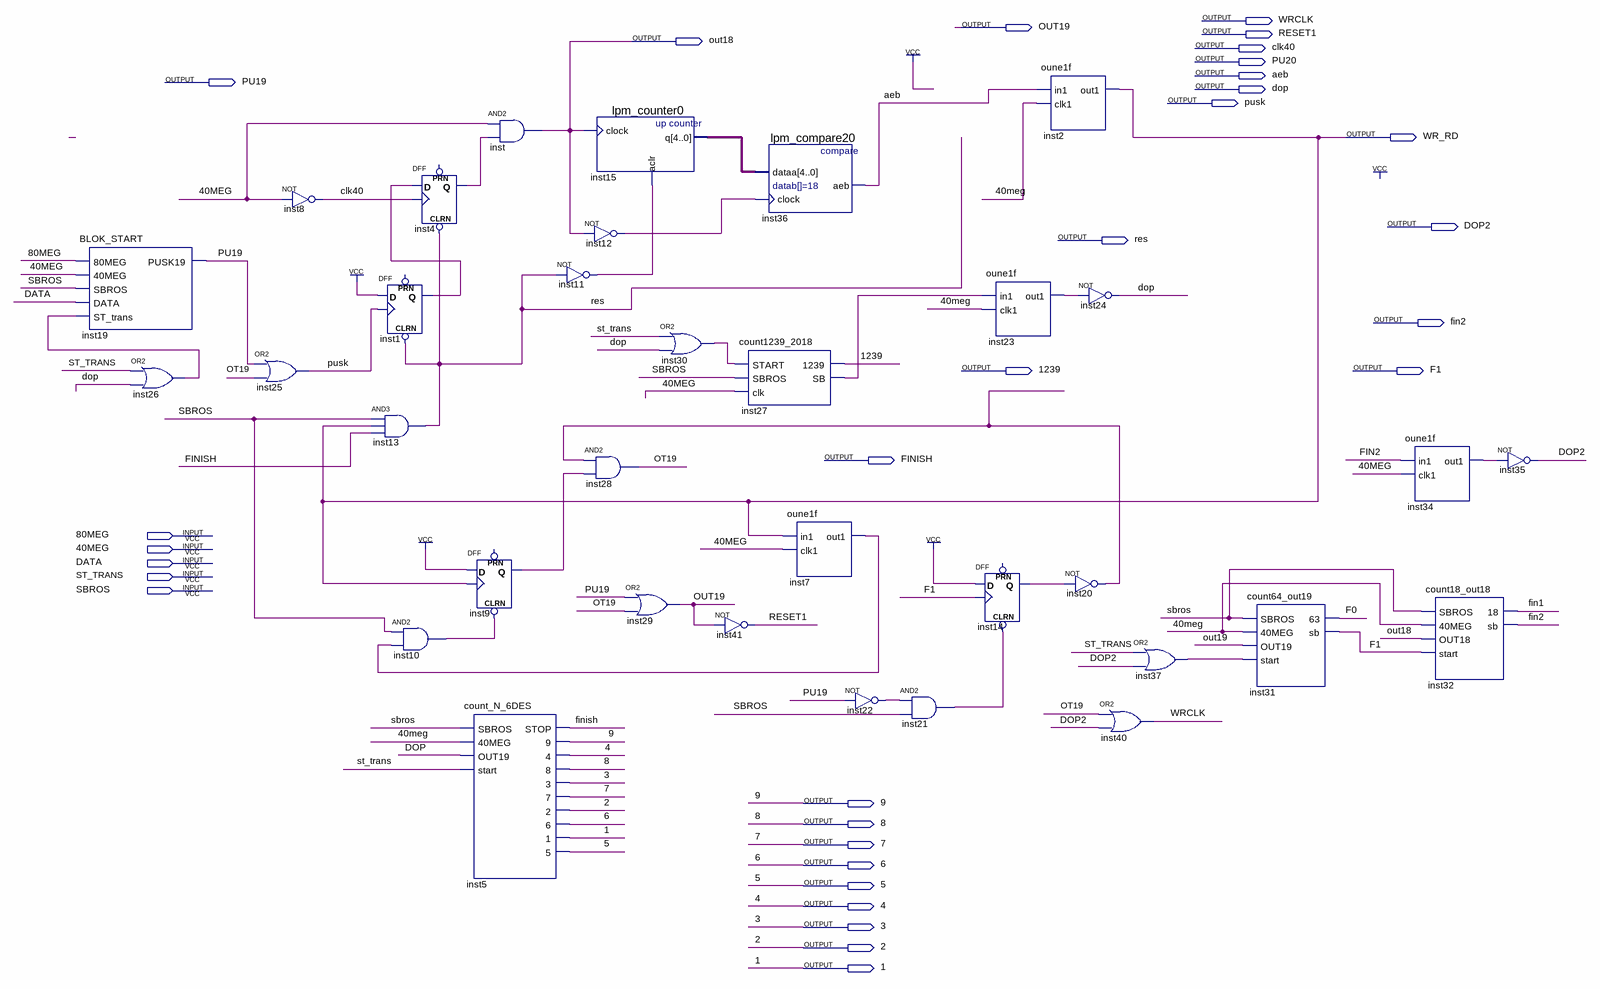
[diagram p0: schematic sheet]
// Quartus schematic BLOK18_19_8DES.bdf as structural Verilog: 34 symbols, 31 pins
module BLOK18_19_8DES (
  input  \80MEG ,
  input  \40MEG ,
  input  DATA,
  input  ST_TRANS,
  input  SBROS,
  output WRCLK,
  output OUT19,
  output RESET1,
  output out18,
  output clk40,
  output PU20,
  output aeb,
  output PU19,
  output dop,
  output pusk,
  output WR_RD,
  output DOP2,
  output res,
  output fin2,
  output \1239 ,
  output F1,
  output FINISH,
  output \9 ,
  output \8 ,
  output \7 ,
  output \6 ,
  output \5 ,
  output \4 ,
  output \3 ,
  output \2 ,
  output \1 
);

  wire F0, fin1, inst1_q, inst4_q, inst7_out1, inst9_q, inst10_out, inst11_out, inst12_out, inst14_q,
       inst20_out, inst21_out, inst22_out, inst23_out1, inst26_out, inst27_sb, inst30_out, inst34_out1,
       inst37_out, OT19;
  wire [4:0] inst15_q;

  BLOK_START inst19 (
    .\80MEG (\80MEG ), .\40MEG (\40MEG ), .SBROS(SBROS), .DATA(DATA), .ST_trans(inst26_out), .PUSK19(PU19));
  or inst26 (inst26_out, ST_TRANS, dop);
  or inst25 (pusk, PU19, OT19);
  not inst8 (clk40, \40MEG );
  and inst13 (res, SBROS, WR_RD, FINISH);
  DFF inst4 (.CLRN(res), .CLK(clk40), .D(inst1_q), .Q(inst4_q));  // open: PRN
  DFF inst1 (.CLRN(res), .CLK(pusk), .D(1'b1), .Q(inst1_q));  // open: PRN
  and inst10 (inst10_out, SBROS, inst7_out1);
  DFF inst9 (.CLRN(inst10_out), .CLK(WR_RD), .D(1'b1), .Q(inst9_q));  // open: PRN
  count_N_6DES inst5 (
    .SBROS(SBROS), .\40MEG (\40MEG ), .OUT19(dop), .start(ST_TRANS), .STOP(FINISH), .\9 (\9 ), .\4 (\4 ),
    .\8 (\8 ), .\3 (\3 ), .\7 (\7 ), .\2 (\2 ), .\6 (\6 ), .\1 (\1 ), .\5 (\5 ));
  and inst (out18, \40MEG , inst4_q);
  lpm_counter0 inst15 (.clock(out18), .aclr(inst11_out), .q(inst15_q));
  not inst12 (inst12_out, out18);
  not inst11 (inst11_out, res);
  and inst28 (OT19, inst20_out, inst9_q);
  or inst29 (OUT19, PU19, OT19);
  or inst30 (inst30_out, ST_TRANS, dop);
  lpm_compare20 inst36 (.dataa(inst15_q), .clock(inst12_out), .aeb(aeb));
  count1239_2018 inst27 (.START(inst30_out), .SBROS(SBROS), .clk(\40MEG ), .\1239 (\1239 ), .SB(inst27_sb));
  not inst41 (RESET1, OUT19);
  oune1f inst7 (.in1(WR_RD), .clk1(\40MEG ), .out1(inst7_out1));
  not inst22 (inst22_out, PU19);
  and inst21 (inst21_out, inst22_out, SBROS);
  DFF inst14 (.CLRN(inst21_out), .CLK(F1), .D(1'b1), .Q(inst14_q));  // open: PRN
  oune1f inst23 (.in1(inst27_sb), .clk1(\40MEG ), .out1(inst23_out1));
  oune1f inst2 (.in1(aeb), .clk1(\40MEG ), .out1(WR_RD));
  not inst24 (dop, inst23_out1);
  not inst20 (inst20_out, inst14_q);
  or inst37 (inst37_out, ST_TRANS, DOP2);
  or inst40 (WRCLK, OT19, DOP2);
  count64_out19 inst31 (.SBROS(SBROS), .\40MEG (\40MEG ), .OUT19(OUT19), .start(inst37_out), .\63 (F0), .sb(F1));
  oune1f inst34 (.in1(fin2), .clk1(\40MEG ), .out1(inst34_out1));
  count18_out18 inst32 (.SBROS(SBROS), .\40MEG (\40MEG ), .OUT18(out18), .start(F1), .\18 (fin1), .sb(fin2));
  not inst35 (DOP2, inst34_out1);
endmodule
